# Altium schematic sheet Block_Diagram.SchDoc
size 420 x 297 mm; Designer: Efe Tunca; ProjectTitle: Earthquake Detector; DocumentTitle: Block Diagram; DateCreated: 21.12.2023; RevisionDate: 26.12.2023; Revision: 2v0; SheetNumber: 1; SheetTotal: 1
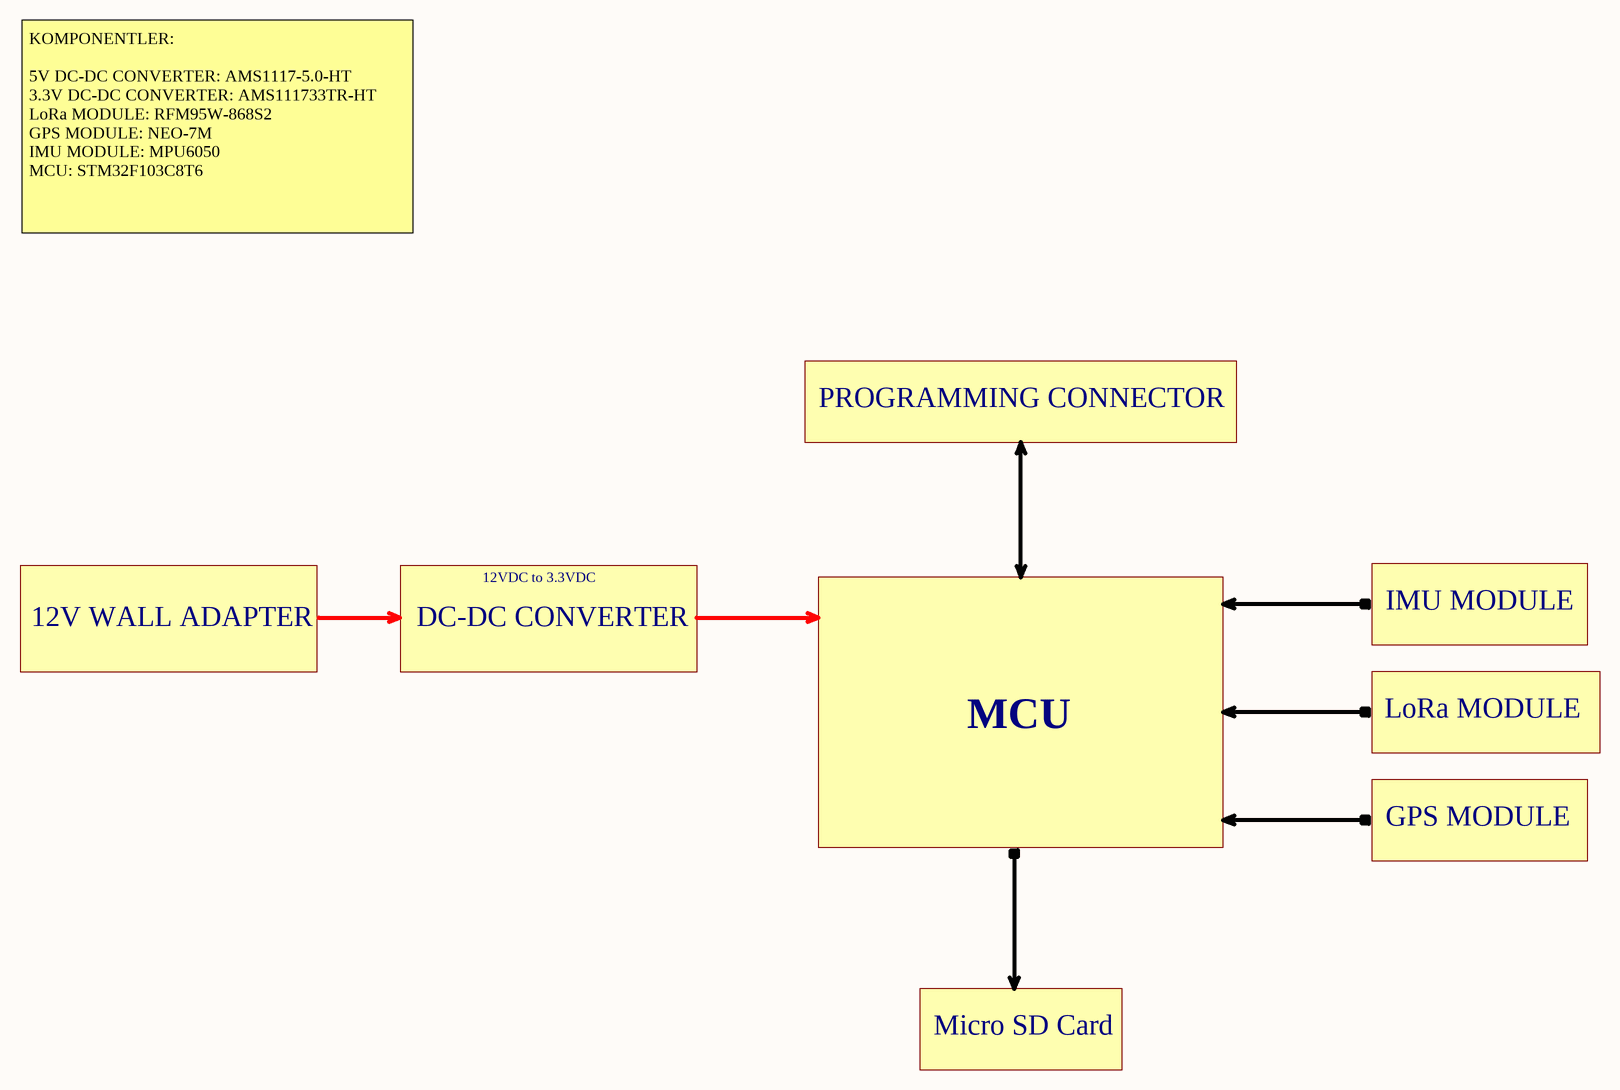
[diagram p0: Block_Diagram.SchDoc]

## Notes on the sheet
- KOMPONENTLER:
  5V DC-DC CONVERTER: AMS1117-5.0-HT
  3.3V DC-DC CONVERTER: AMS111733TR-HT
  LoRa MODULE: RFM95W-868S2
  GPS MODULE: NEO-7M
  IMU MODULE: MPU6050
  MCU: STM32F103C8T6
- PROGRAMMING CONNECTOR
- 12VDC to 3.3VDC
- 12V WALL ADAPTER
- DC-DC CONVERTER
- IMU MODULE
- LoRa MODULE
- MCU
- GPS MODULE
- Micro SD Card
- Document Name:
- Project Name:
- Designer:
- Date Created:
- Revision Date:
- Revision: